# EAGLE design L298_treiber_2 (EAGLE 4.16)
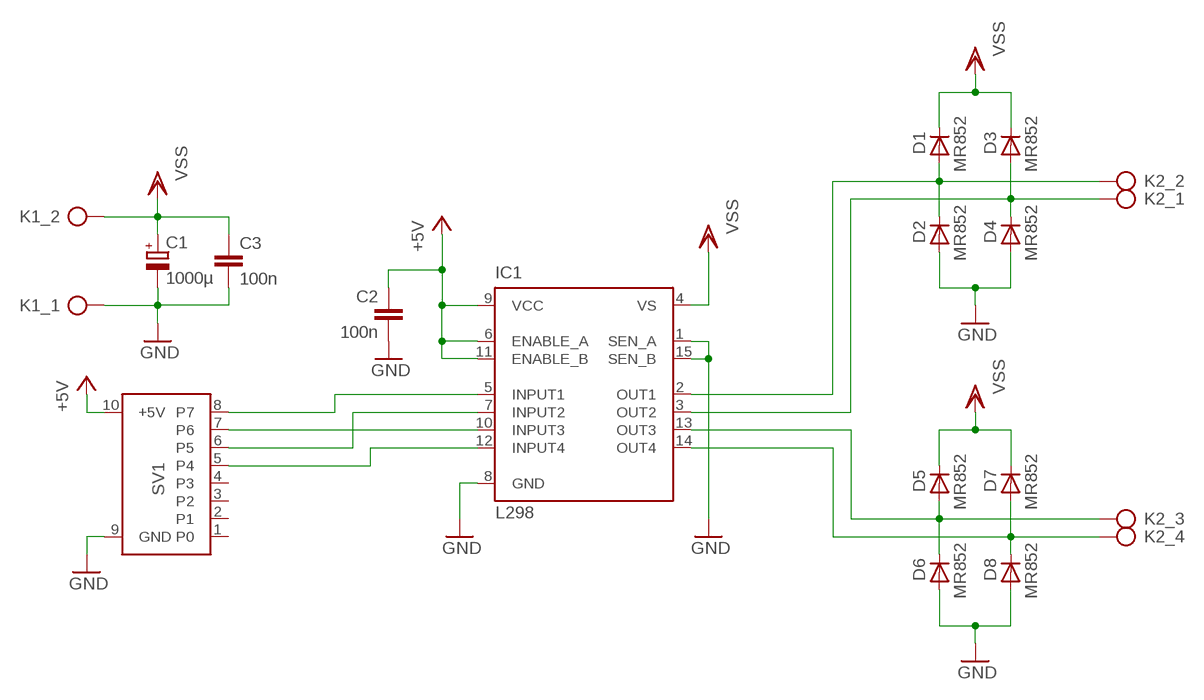
[diagram p0: schematic, sheet 1]

## Parts
C1  1000µ  CPOL-EUE5-13  [E5-13]
C2  100n  C-EU050-024X044  [C050-024X044]
C3  100n  C-EU050-024X044  [C050-024X044]
D1  MR852  1N5624  [DO201-15]
D2  MR852  1N5624  [DO201-15]
D3  MR852  1N5624  [DO201-15]
D4  MR852  1N5624  [DO201-15]
D5  MR852  1N5624  [DO201-15]
D6  MR852  1N5624  [DO201-15]
D7  MR852  1N5624  [DO201-15]
D8  MR852  1N5624  [DO201-15]
IC1  L298  [MULTIWATT-15]
K1  AKL_KLEMME_2POLIG073  [AKL073-02]
K2  AST021-04  [AST021-04]
SV1  PORT_WANNSTECKER  [ML10]

## Nets
+5V: C2.1 IC1.6(ENABLE_A) IC1.9(VCC) IC1.11(ENABLE_B) SV1.10(+5V)
GND: C1.- C2.2 C3.2 D2.A D4.A D6.A D8.A IC1.1(SEN_A) IC1.8(GND) IC1.15(SEN_B) K1.1 SV1.9(GND)
N$1: D1.A D2.C IC1.2(OUT1) K2.2
N$2: D3.A D4.C IC1.3(OUT2) K2.1
N$3: IC1.5(INPUT1) SV1.8(P7)
N$4: IC1.7(INPUT2) SV1.6(P5)
N$5: D5.A D6.C IC1.13(OUT3) K2.3
N$6: D7.A D8.C IC1.14(OUT4) K2.4
N$7: IC1.10(INPUT3) SV1.7(P6)
N$8: IC1.12(INPUT4) SV1.5(P4)
VSS: C1.+ C3.1 D1.C D3.C D5.C D7.C IC1.4(VS) K1.2
Unconnected: SV1.1(P0) SV1.2(P1) SV1.3(P2) SV1.4(P3)

## Library data of the parts
C1 = rcl:CPOL-EU: POLARIZED CAPACITOR, European symbol
C2 C3 = rcl:C-EU: CAPACITOR, European symbol
D1-D8 = diode:1N5624: DIODE controlled avalanche rectifier
IC1 = st-microelectronics:L298: DUAL FULL-BRIDGE DRIVER
K1 = 01-Schraubklemmen:AKL_KLEMME_2POLIG: Reichelt Klemme 2-Polig RM5,08
K2 = 01-Klemmen:AST021-04
SV1 = 01-Steckverbinder:PORT_WANNSTECKER

## Board
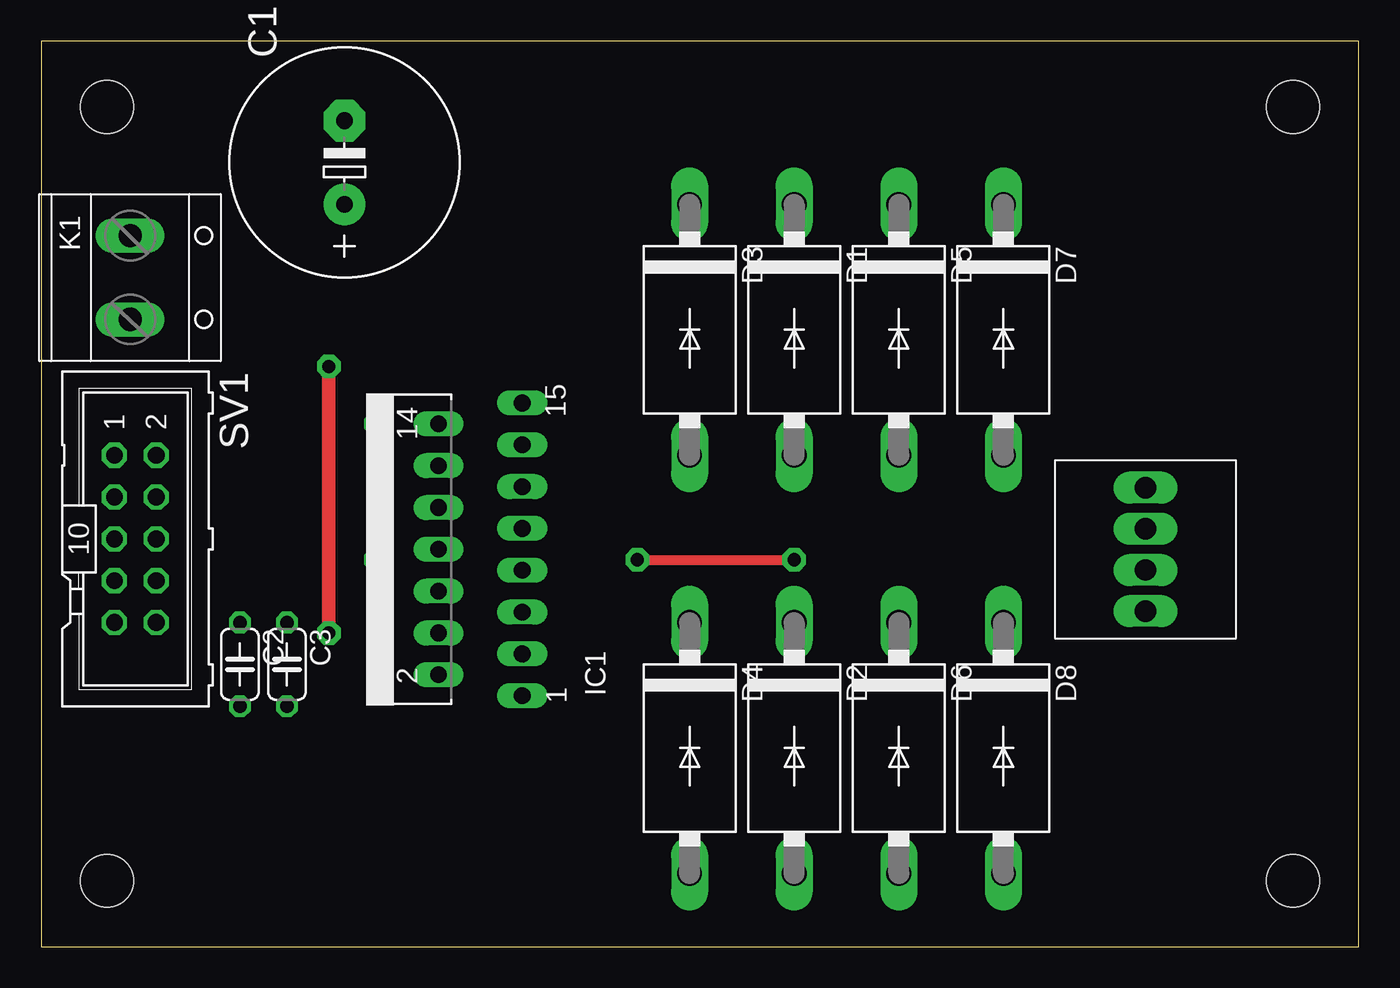
[diagram p1: board, top side]
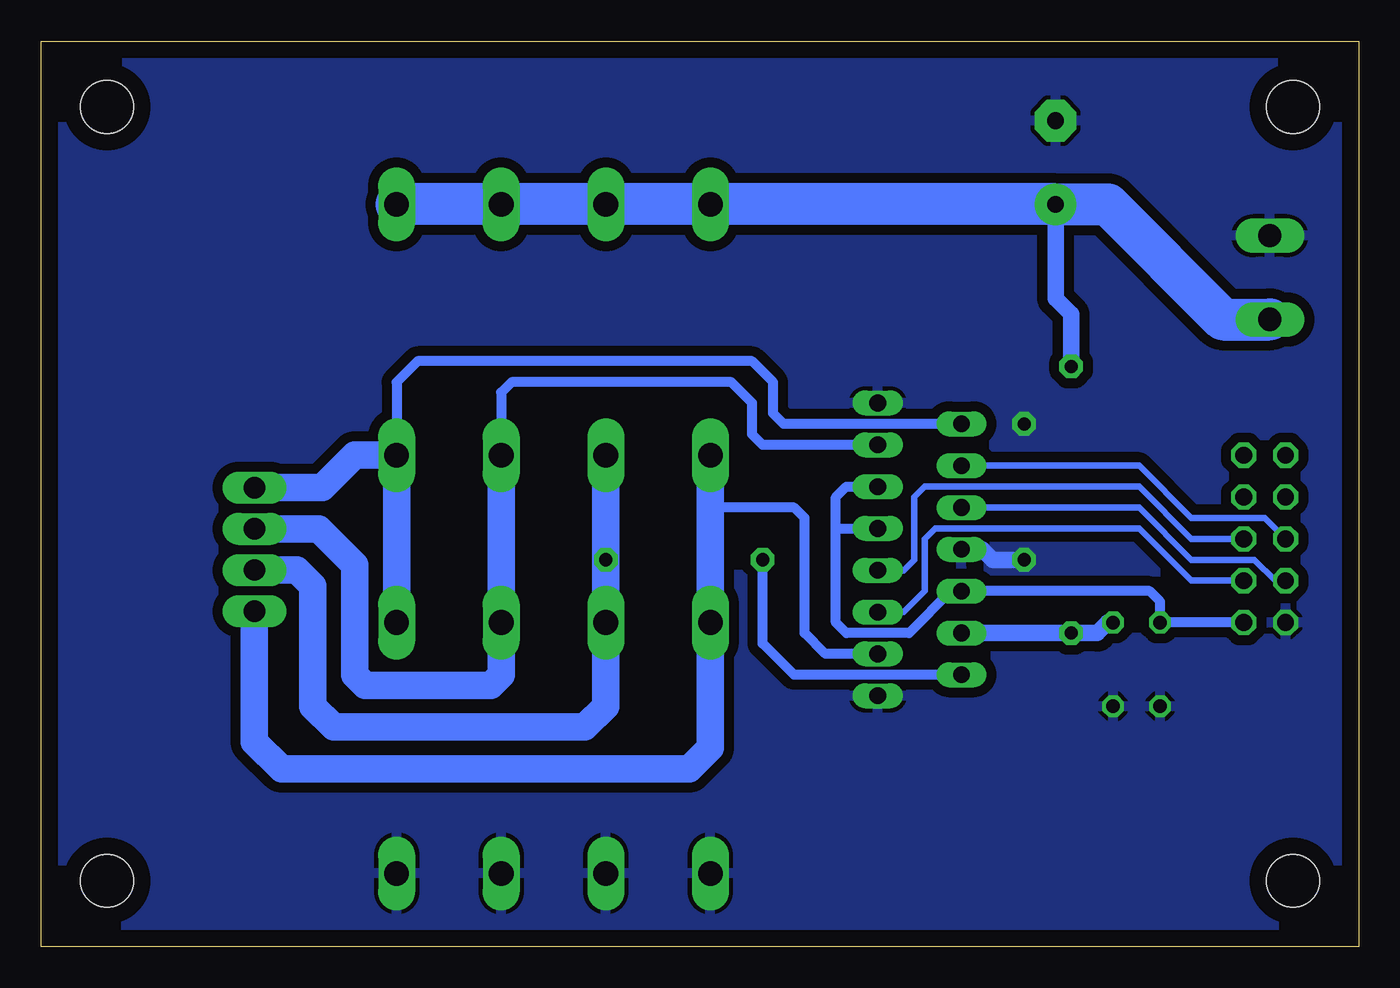
[diagram p2: board, bottom side, seen from below]

Size 80 x 55 mm. Coordinates in mm from the lower left corner, seen from the top.
Outline: 0,0 80,0 80,55 0,55 0,0
Copper layers (1*16): Top 0.035mm / dielectric 1.5mm / Bottom 0.035mm
Design rules "default": minimum track width 10mil, minimum drill 24mil, track to track 0.2mm, track to pad 0.2mm, pad to pad 0.2mm, via to via 0.2mm, smd to smd 0.2mm, copper to edge 40mil, drill to drill 8mil, minimum pad ring 10mil, minimum via ring 8mil, stop-mask expansion 4mil, vias tented up to drill 0mil, thermal gap 10mil
Holes 3.2 mm at 76,4 76,51 4,51 4,4

### Footprints (pad centres in the part's own frame; a part is rotated, then mirrored left to right if it is on the bottom)
E5-13 = drill 1.016 pad 2.54 round: + -2.54,0 | drill 1.016 pad 2.54 octagon: - 2.54,0
C050-024X044 = drill 0.813 octagon: 1 -2.54,0; 2 2.54,0
DO201-15 = drill 1.499 long: A 7.62,0; C -7.62,0
MULTIWATT-15 = drill 1.016 long: 1 -8.89,-7.62; 2 -7.62,-2.54; 3 -6.35,-7.62; 4 -5.08,-2.54; 5 -3.81,-7.62; 6 -2.54,-2.54; 7 -1.27,-7.62; 8 0,-2.54; 9 1.27,-7.62; 10 2.54,-2.54; 11 3.81,-7.62; 12 5.08,-2.54; 13 6.35,-7.62; 14 7.62,-2.54; 15 8.89,-7.62
AKL073-02 = drill 1.4 long: 1 -2.54,0; 2 2.54,0
AST021-04 = drill 1.3 long: 1 -3.75,0; 2 -1.25,0; 3 1.25,0; 4 3.75,0
ML10 = drill 1.016 octagon: 1 -5.08,-1.27; 2 -5.08,1.27; 3 -2.54,-1.27; 4 -2.54,1.27; 5 0,-1.27; 6 0,1.27; 7 2.54,-1.27; 8 2.54,1.27; 9 5.08,-1.27; 10 5.08,1.27

### Placement (x,y rotation side)
C1  18.41,47.62 90 top
C2  12.06,17.14 270 top
C3  14.92,17.14 270 top
D1  45.72,37.47 270 top
D2  45.72,12.06 270 top
D3  39.37,37.47 270 top
D4  39.37,12.06 270 top
D5  52.07,37.47 270 top
D6  52.07,12.06 270 top
D7  58.42,37.47 270 top
D8  58.42,12.06 270 top
IC1  21.59,24.13 90 top
K1  5.4,40.64 270 top
K2  67.05,24.13 90 top
SV1  5.71,24.77 270 top

### Tracks (layer width: path | path; a pad name or v marks a point on that pad's centre or on a via)
+5V
  Bottom 0.61: SV1.10 C2.1 12.06,20.95 12.7,21.59 IC1.6 24.77,21.59 27.3,19.05 31.11,19.05 31.75,19.68 31.75,25.4 | 31.75,25.4 31.75,27.3 31.11,27.94 IC1.11 | 31.75,25.4 IC1.9
GND  (via drill 0.8 pad 1.42)
  Top 0.813: v20.32,23.5 v20.32,31.75
  Bottom 1.016: IC1.8 22.86,24.13 22.23,23.5 v20.32,23.5
  pour Bottom (isolate 0.61): 0,0 0,55 80,55 80,0
N$1  (via drill 0.8 pad 1.42)
  Top 0.61: v36.2,23.5 v45.72,23.5
  Bottom 0.61: D2.C 45.72,17.78 | IC1.2 34.29,16.51 36.2,18.41 v36.2,23.5
  Bottom 1.676: D1.A v45.72,23.5 D2.C 45.72,14.61 46.99,13.34 62.23,13.34 63.5,14.61 63.5,21.91 64.47,22.88 K2.2
N$2
  Bottom 0.61: IC1.3 32.38,17.78 33.66,19.05 33.66,26.04 34.29,26.67 39.37,26.67
  Bottom 1.676: D3.A 39.37,26.67 D4.C 39.37,12.06 40.64,10.79 65.41,10.79 67.05,12.44 K2.1
N$3
  Bottom 0.406: SV1.8 10.16,22.23 13.34,25.4 25.72,25.4 26.35,24.77 26.35,21.59 27.62,20.32 IC1.5
N$4
  Bottom 0.406: SV1.6 10.16,24.77 13.34,27.94 26.35,27.94 26.99,27.3 26.99,23.5 27.62,22.86 IC1.7
N$5
  Bottom 0.61: IC1.13 36.2,30.48 36.83,31.11 36.83,33.02 38.1,34.29 51.44,34.29 52.07,33.66 D5.A
  Bottom 1.676: D5.A D6.C 52.07,16.51 52.7,15.88 60.33,15.88 60.96,16.51 60.96,23.18 63.16,25.38 K2.3
N$6
  Bottom 0.61: 58.42,30.48 D7.A 58.42,34.29 57.15,35.56 36.83,35.56 35.56,34.29 35.56,32.38 34.92,31.75 IC1.14
  Bottom 1.676: D8.C D7.A 60.96,29.84 62.93,27.88 K2.4
N$7
  Bottom 0.406: SV1.7 5.08,22.23 6.35,23.5 10.16,23.5 13.34,26.67 IC1.10
N$8
  Bottom 0.406: SV1.5 5.71,26.04 10.16,26.04 13.34,29.21 IC1.12
VSS  (via drill 0.8 pad 1.42)
  Top 0.813: v17.46,19.05 v17.46,35.24
  Bottom 1.016: 17.78,19.05 IC1.4 | v17.46,35.24 17.46,38.42 18.41,39.37 C1.+ | C3.1 15.24,19.68 15.88,19.05 17.78,19.05 | 17.78,19.05 v17.46,19.05
  Bottom 2.54: D7.C D5.C D1.C D3.C C1.+ 15.24,45.09 8.26,38.1 K1.2